# Altium schematic sheet headers.SchDoc: CRUVI
size A4; Organization: Trenz Electronic GmbH; DocumentNumber: CR00041; Revision: 01; SheetNumber: 1; SheetTotal: 2; Date: 2019-11-14; CompanyName: Trenz Electronic GmbH
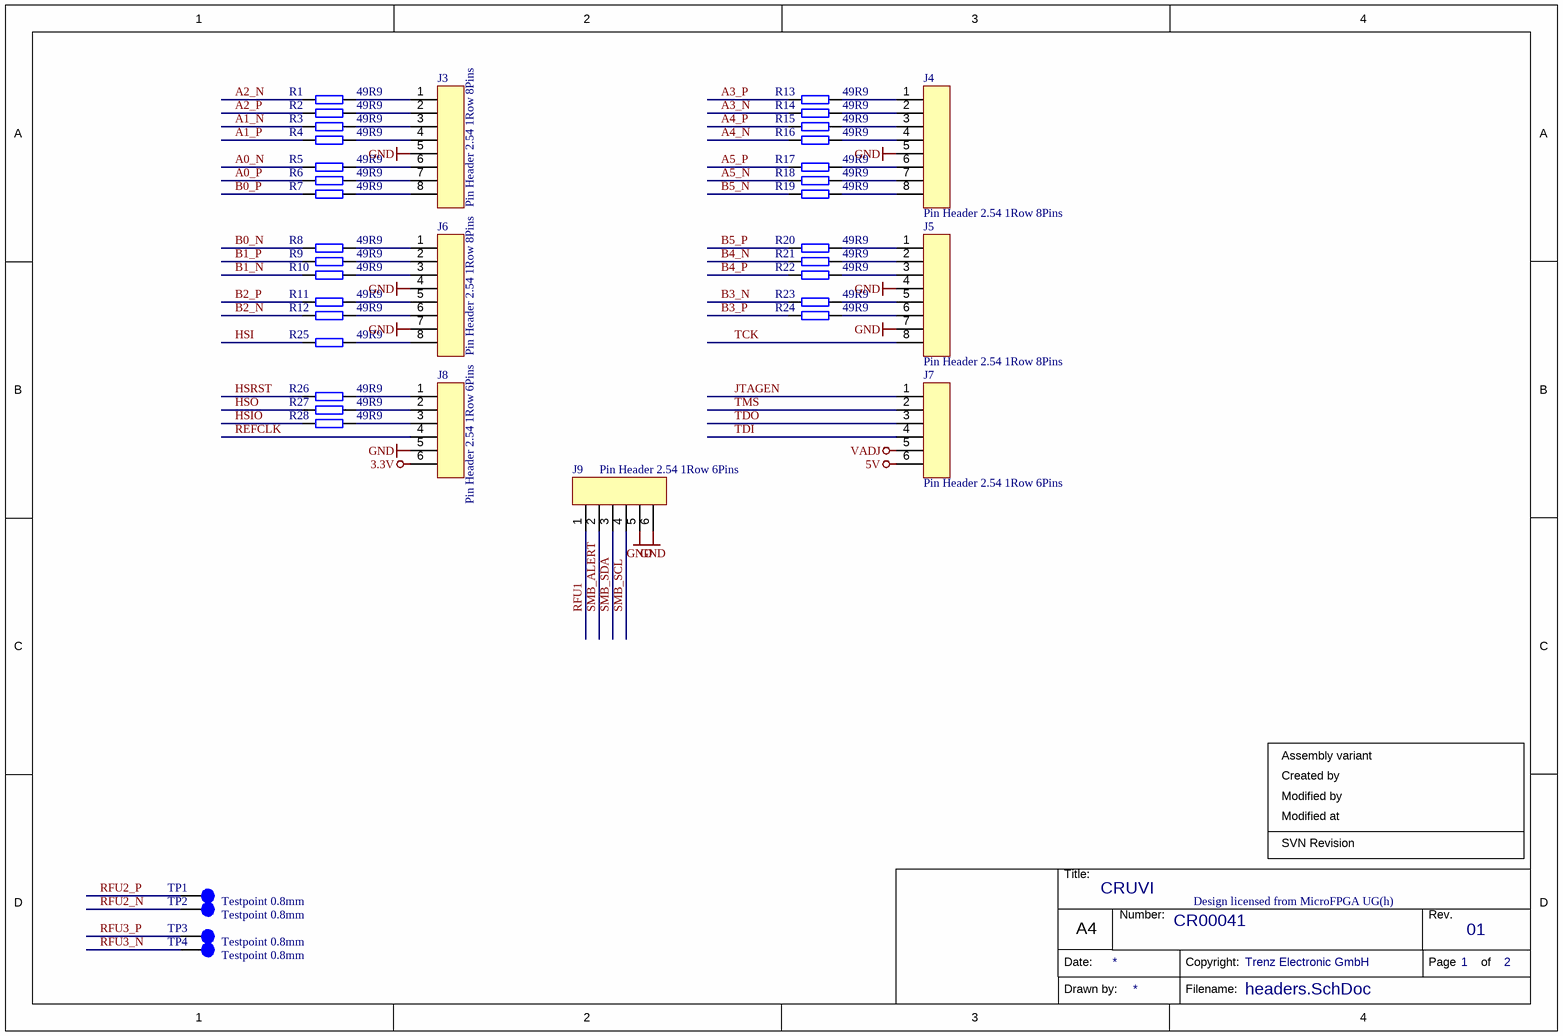
[diagram p0: headers.SchDoc]

## Parts
J3  Pin Header 2.54 1Row 8Pins  [STIFTLEISTE2_54 OG 1R-8V]
J4  Pin Header 2.54 1Row 8Pins  [STIFTLEISTE2_54 OG 1R-8V]
J5  Pin Header 2.54 1Row 8Pins  [STIFTLEISTE2_54 OG 1R-8V]
J6  Pin Header 2.54 1Row 8Pins  [STIFTLEISTE2_54 OG 1R-8V]
J7  Pin Header 2.54 1Row 6Pins  [STIFTLEISTE2_54 OG 1R-6]
J8  Pin Header 2.54 1Row 6Pins  [STIFTLEISTE2_54 OG 1R-6]
J9  Pin Header 2.54 1Row 6Pins  [STIFTLEISTE2_54 OG 1R-6]
R1  49R9  [RESC0603X26N_V]
R2  49R9  [RESC0603X26N_V]
R3  49R9  [RESC0603X26N_V]
R4  49R9  [RESC0603X26N_V]
R5  49R9  [RESC0603X26N_V]
R6  49R9  [RESC0603X26N_V]
R7  49R9  [RESC0603X26N_V]
R8  49R9  [RESC0603X26N_V]
R9  49R9  [RESC0603X26N_V]
R10  49R9  [RESC0603X26N_V]
R11  49R9  [RESC0603X26N_V]
R12  49R9  [RESC0603X26N_V]
R13  49R9  [RESC0603X26N_V]
R14  49R9  [RESC0603X26N_V]
R15  49R9  [RESC0603X26N_V]
R16  49R9  [RESC0603X26N_V]
R17  49R9  [RESC0603X26N_V]
R18  49R9  [RESC0603X26N_V]
R19  49R9  [RESC0603X26N_V]
R20  49R9  [RESC0603X26N_V]
R21  49R9  [RESC0603X26N_V]
R22  49R9  [RESC0603X26N_V]
R23  49R9  [RESC0603X26N_V]
R24  49R9  [RESC0603X26N_V]
R25  49R9  [RESC0603X26N_V]
R26  49R9  [RESC0603X26N_V]
R27  49R9  [RESC0603X26N_V]
R28  49R9  [RESC0603X26N_V]
TP1  Testpoint 0.8mm  [TP_0.8mm]
TP2  Testpoint 0.8mm  [TP_0.8mm]
TP3  Testpoint 0.8mm  [TP_0.8mm]
TP4  Testpoint 0.8mm  [TP_0.8mm]

## Nets
3.3V: J8.6
5V: J7.6
GND: J3.5 J4.5 J5.4 J5.7 J6.4 J6.7 J8.5 J9.5 J9.6
VADJ: J7.5
A0_N: R5.1
A0_P: R6.1
A1_N: R3.1
A1_P: R4.1
A2_N: R1.1
A2_P: R2.1
A3_N: R14.1
A3_P: R13.1
A4_N: R16.1
A4_P: R15.1
A5_N: R18.1
A5_P: R17.1
B0_N: R8.1
B0_P: R7.1
B1_N: R10.1
B1_P: R9.1
B2_N: R12.1
B2_P: R11.1
B3_N: R23.1
B3_P: R24.1
B4_N: R21.1
B4_P: R22.1
B5_N: R19.1
B5_P: R20.1
HSI: R25.1
HSIO: R28.1
HSO: R27.1
HSRST: R26.1
JTAGEN: J7.1
REFCLK: J8.4
RFU1: J9.1
RFU2_N: TP2.1
RFU2_P: TP1.1
RFU3_N: TP4.1
RFU3_P: TP3.1
SMB_ALERT: J9.2
SMB_SCL: J9.4
SMB_SDA: J9.3
TCK: J5.8
TDI: J7.4
TDO: J7.3
TMS: J7.2
NetJ3_1: J3.1 R1.2
NetJ3_2: J3.2 R2.2
NetJ3_3: J3.3 R3.2
NetJ3_4: J3.4 R4.2
NetJ3_6: J3.6 R5.2
NetJ3_7: J3.7 R6.2
NetJ3_8: J3.8 R7.2
NetJ4_1: J4.1 R13.2
NetJ4_2: J4.2 R14.2
NetJ4_3: J4.3 R15.2
NetJ4_4: J4.4 R16.2
NetJ4_6: J4.6 R17.2
NetJ4_7: J4.7 R18.2
NetJ4_8: J4.8 R19.2
NetJ5_1: J5.1 R20.2
NetJ5_2: J5.2 R21.2
NetJ5_3: J5.3 R22.2
NetJ5_5: J5.5 R23.2
NetJ5_6: J5.6 R24.2
NetJ6_1: J6.1 R8.2
NetJ6_2: J6.2 R9.2
NetJ6_3: J6.3 R10.2
NetJ6_5: J6.5 R11.2
NetJ6_6: J6.6 R12.2
NetJ6_8: J6.8 R25.2
NetJ8_1: J8.1 R26.2
NetJ8_2: J8.2 R27.2
NetJ8_3: J8.3 R28.2

## Notes on the sheet
- Assembly variant
- Created by
- Modified at
- Modified by
- SVN Revision
- Design licensed from MicroFPGA UG(h)
- Title:
- Number:
- Rev.
- Date:
- A4
- Copyright:
- Page
- of
- Drawn by:
- Filename:

## Library data of the parts
J3-J6 = 29846: Stiftleiste versetzt 1-reihig, 8pol.; AN: 29846; Mixed: THT; H-ART: 943-12-08-00; Extra: 2,54mm RM, 5,5mm Stiftlänge, vergoldet; Trenz-Stock: Yes; HelpURL: b:\AD\adlib\datasheet\W+P_943_944_945\
J7-J9 = 28042: Stiftleiste gerade 1-reihig, 6pol; AN: 28042; Mixed: THT; H-ART: 943-12-006-00; Extra: 2,54mm RM, 11,3mm Stiftlänge, vergoldet
R1-R28 = 26669: WID SMD 49R9 1% 0,05W BF 0603 (0201); AN: 26669; Voltage: 25V; Mixed: SMT; Trenz-Stock: Yes; Value: 49.9; Tolerance: 1%; Case: 0603 (0201); Technology: TK100; HelpURL: B:\AD\adlib\datasheet\R0201
TP1-TP4 = 26289: AN: 26289; Mixed: MECH